# EAGLE design Nabila (EAGLE 9.6.2)
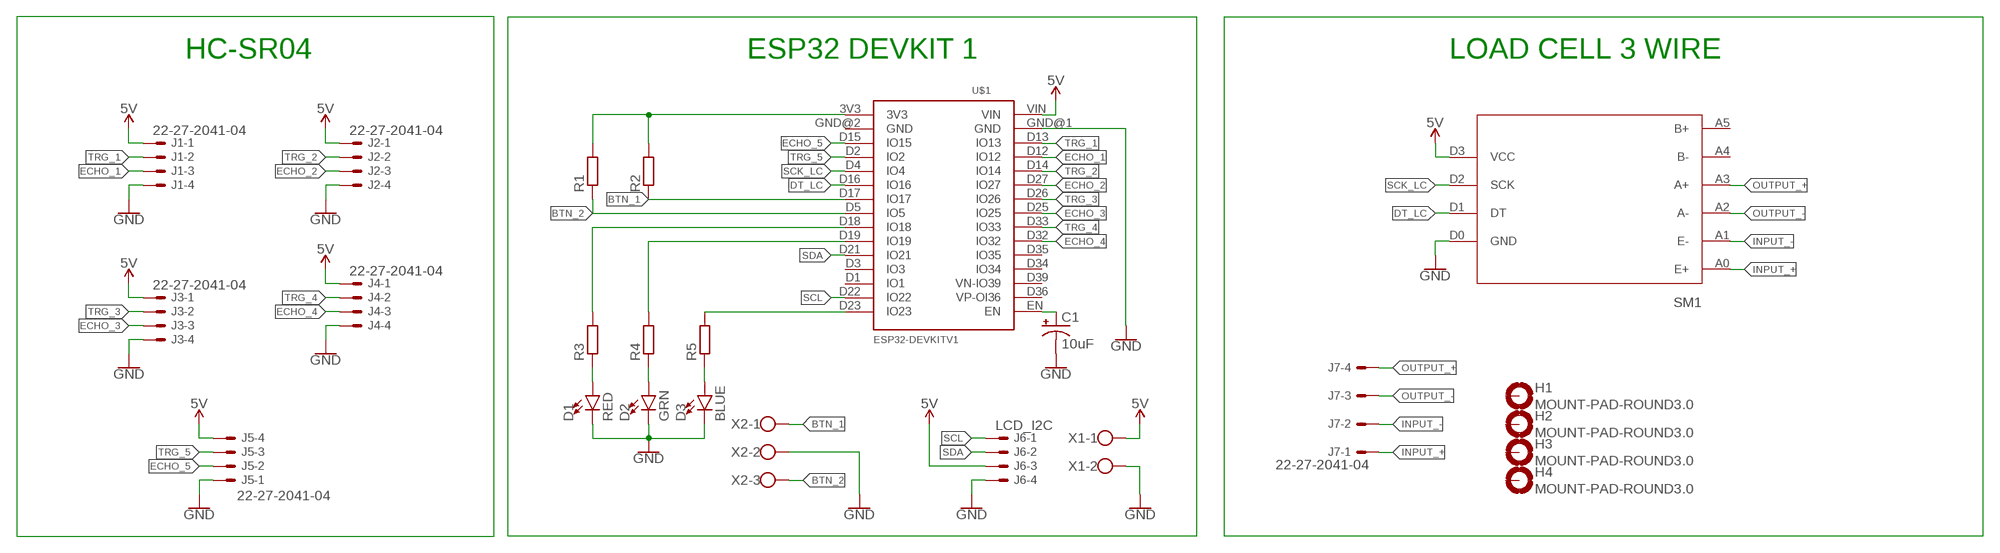
[diagram p0: schematic, sheet 1]

## Parts
C1  10uF  CPOL-USE2-5  [E2-5]
D1  RED  LED5MM  [LED_5MM]
D2  GRN  LED5MM  [LED_5MM]
D3  BLUE  LED5MM  [LED_5MM]
H1  MOUNT-PAD-ROUND3.0  [3,0-PAD]
H2  MOUNT-PAD-ROUND3.0  [3,0-PAD]
H3  MOUNT-PAD-ROUND3.0  [3,0-PAD]
H4  MOUNT-PAD-ROUND3.0  [3,0-PAD]
J1  22-27-2041-04  [6410-04]
J2  22-27-2041-04  [6410-04]
J3  22-27-2041-04  [6410-04]
J4  22-27-2041-04  [6410-04]
J5  22-27-2041-04  [6410-04]
J6  LCD_I2C  22-27-2041-04  [6410-04]
J7  22-27-2041-04  [6410-04]
R1  R-EU_0207/10  [0207/10]
R2  R-EU_0207/10  [0207/10]
R3  R-EU_0207/10  [0207/10]
R4  R-EU_0207/10  [0207/10]
R5  R-EU_0207/10  [0207/10]
SM1  HX711  [HX711]
U$1  ESP32DEVKITV1  [ESP32-DEVKITV1]
X1  W237-102  [W237-102]
X2  W237-103  [W237-103]

## Nets
5V: J1.1 J2.1 J3.1 J4.1 J5.4 J6.3 SM1.D3(VCC) U$1.VIN X1.1
BTN_1: R2.1 U$1.D17(IO17) X2.1
BTN_2: R1.1 U$1.D5(IO5) X2.3
DT_LC: SM1.D1(DT) U$1.D16(IO16)
ECHO_1: J1.3 U$1.D12(IO12)
ECHO_2: J2.3 U$1.D27(IO27)
ECHO_3: J3.3 U$1.D25(IO25)
ECHO_4: J4.3 U$1.D32(IO32)
ECHO_5: J5.2 U$1.D15(IO15)
GND: C1.- D1.K(C) D2.K(C) D3.K(C) J1.4 J2.4 J3.4 J4.4 J5.1 J6.4 SM1.D0(GND) U$1.GND@1(GND) X1.2 X2.2
INPUT_+: J7.1 SM1.A0(E+)
INPUT_-: J7.2 SM1.A1(E-)
N$1: R1.2 R2.2 U$1.3V3
N$4: R3.2 U$1.D18(IO18)
N$5: R4.2 U$1.D19(IO19)
N$6: R5.2 U$1.D23(IO23)
N$7: D1.A R3.1
N$8: D2.A R4.1
N$9: D3.A R5.1
N$11: C1.+ U$1.EN
OUTPUT_+: J7.4 SM1.A3(A+)
OUTPUT_-: J7.3 SM1.A2(A-)
SCK_LC: SM1.D2(SCK) U$1.D4(IO4)
SCL: J6.1 U$1.D22(IO22)
SDA: J6.2 U$1.D21(IO21)
TRG_1: J1.2 U$1.D13(IO13)
TRG_2: J2.2 U$1.D14(IO14)
TRG_3: J3.2 U$1.D26(IO26)
TRG_4: J4.2 U$1.D33(IO33)
TRG_5: J5.3 U$1.D2(IO2)
Unconnected: H1.B3,0(MOUNT) H2.B3,0(MOUNT) H3.B3,0(MOUNT) H4.B3,0(MOUNT) SM1.A4(B-) SM1.A5(B+) U$1.D1(IO1) U$1.D3(IO3) U$1.D34(IO34) U$1.D35(IO35) U$1.D36(VP-OI36) U$1.D39(VN-IO39) U$1.GND@2(GND)

## Notes on the sheet
- HC-SR04 | ESP32 DEVKIT 1 | LOAD CELL 3 WIRE

## Library data of the parts
C1 = rcl:CPOL-US: POLARIZED CAPACITOR, American symbol; SPICEPREFIX: C
D1-D3 = 1206_led:LED: LED (Generic) Standard schematic elements and footprints for 5mm, 3mm, 1206, and 0603 sized LEDs. Generic LEDs with no color specified.
H1-H4 = holes:MOUNT-PAD-ROUND: MOUNTING PAD, round
J1-J7 = con-molex:22-?-04: CONNECTOR wire to board 2.54 mm (.1 inch) pitch header; MF: MOLEX; OC_FARNELL: unknown; OC_NEWARK: unknown
R1-R5 = resistor:R-EU_: RESISTOR, European symbol
SM1 = hx711:HX711: HX711 module is a Load Cell Amplifier breakout board for the HX711 IC that allows you to easily read load cells to measure weight. This module uses 24 high precision A/D converter chip HX711. It is a specially designed for the high precision electronic scale design, with two analog input channel, the internal integration of 128 times the programmable gain amplifier. The input circuit can be configured to provide a bridge type pressure bridge (such as pressure, weighing sensor mode), is of high precision, low cost is an ideal sampling front-end module.
U$1 = ESP32-DEVKITV1:ESP32DEVKITV1
X1 = con-wago-500:W237-102: WAGO SCREW CLAMP; MPN: 237-102; OC_FARNELL: unknown; OC_NEWARK: 70K9898
X2 = con-wago-500:W237-103: WAGO SCREW CLAMP; MPN: 237-103; OC_FARNELL: unknown; OC_NEWARK: 18M7116

## Board
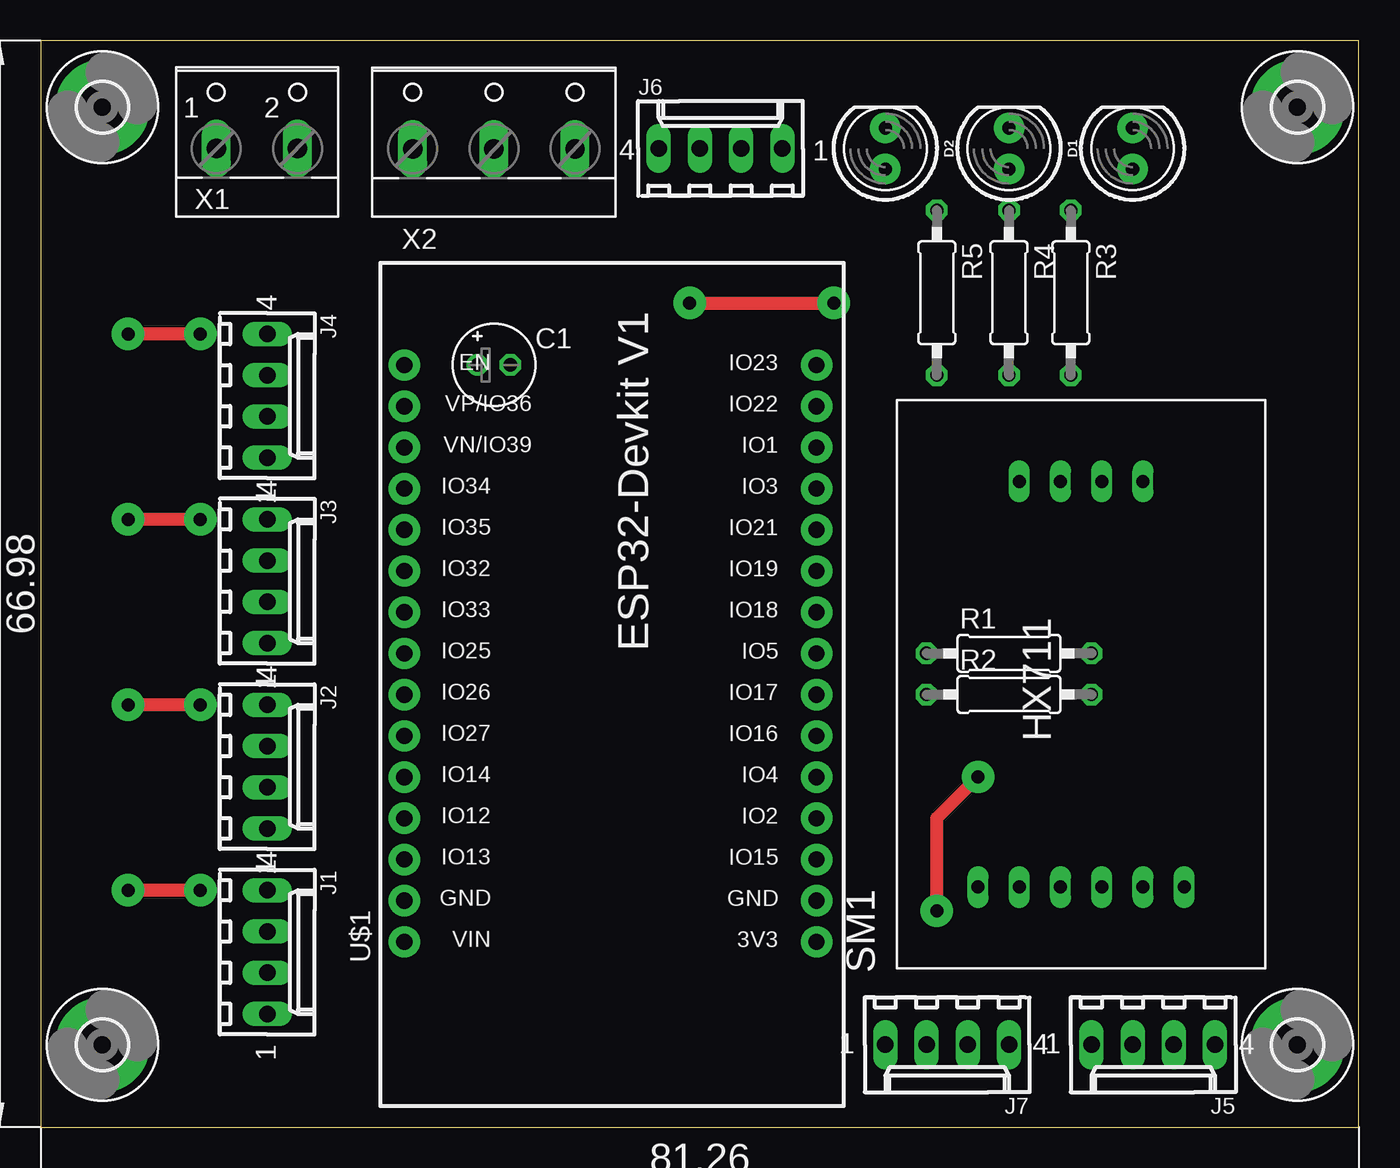
[diagram p1: board, top side]
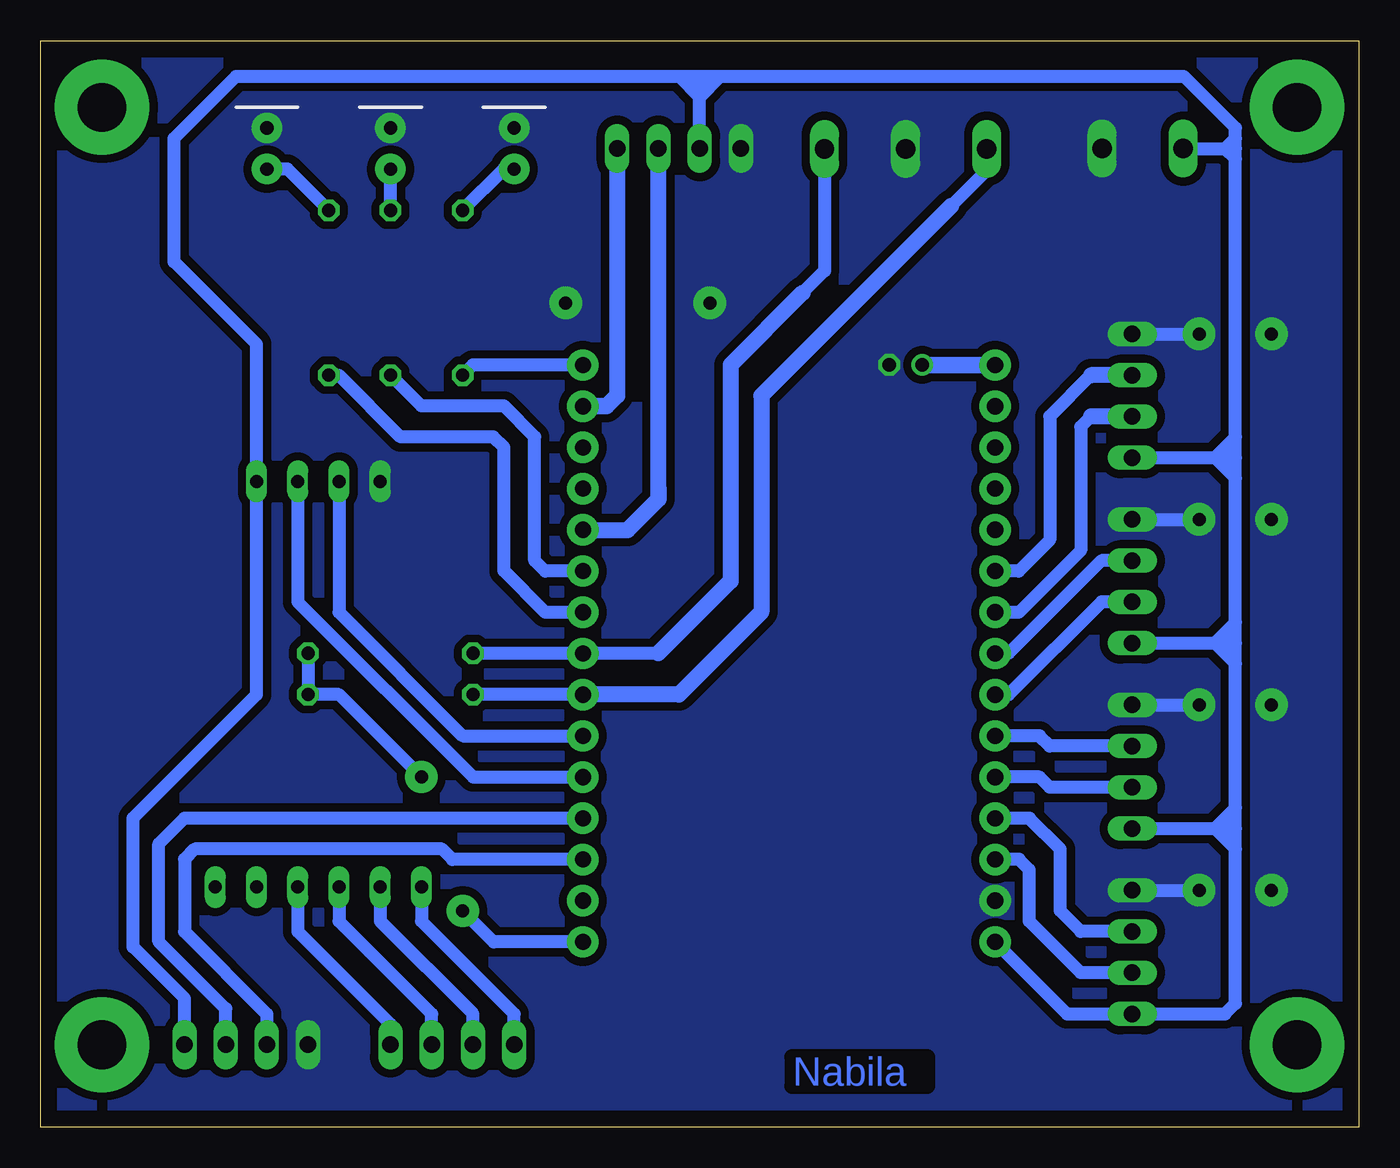
[diagram p2: board, bottom side, seen from below]

Size 81.26 x 66.98 mm. Coordinates in mm from the lower left corner, seen from the top.
Outline: 0,0 81.26,0 81.26,66.98 0,66.98 0,0
Copper layers (1*16): Top 0.035mm / dielectric 1.5mm / Bottom 0.035mm
Design rules "default *": minimum track width 32mil, minimum drill 0.35mm, track to track 0.5mm, track to pad 0.5mm, pad to pad 0.5mm, via to via 0.5mm, smd to smd 6mil, copper to edge 40mil, drill to drill 6mil, minimum pad ring 10mil, minimum via ring 8mil, stop-mask expansion 4mil, vias tented up to drill 0mil, thermal gap 10mil

### Footprints (pad centres in the part's own frame; a part is rotated, then mirrored left to right if it is on the bottom)
E2-5 = drill 0.813 pad 1.27: + -1.016,0 | drill 0.813 pad 1.27 octagon: - 1.016,0
LED_5MM = drill 0.813 pad 1.88: A -1.27,0; K 1.27,0
3,0-PAD = drill 3 pad 5.842: B3,0 0,0
6410-04 = drill 1.016 long: 1 3.81,0; 2 1.27,0; 3 -1.27,0; 4 -3.81,0
0207/10 = drill 0.813 octagon: 1 -5.08,0; 2 5.08,0
HX711 = drill 0.8 long: A0 -12.5,6.35; A1 -12.5,3.81; A2 -12.5,1.27; A3 -12.5,-1.27; A4 -12.5,-3.81; A5 -12.5,-6.35; D0 12.5,3.81; D1 12.5,1.27; D2 12.5,-1.27; D3 12.5,-3.81
ESP32-DEVKITV1 = drill 1 pad 1.93: 3V3 -16.52,-12.27; D1 13.96,-12.27; D2 -8.9,-12.27; D3 11.42,-12.27; D4 -6.36,-12.27; D5 1.26,-12.27; D12 -8.9,13.135; D13 -11.44,13.135; D14 -6.36,13.135; D15 -11.44,-12.27; D16 -3.82,-12.27; D17 -1.28,-12.27; D18 3.8,-12.27; D19 6.34,-12.27; D21 8.88,-12.27; D22 16.5,-12.27; D23 19.04,-12.27; D25 1.26,13.135; D26 -1.28,13.135; D27 -3.82,13.135; D32 6.34,13.135; D33 3.8,13.135; D34 11.42,13.135; D35 8.88,13.135; D36 16.5,13.135; D39 13.96,13.135; EN 19.04,13.135; GND@1 -13.98,13.135; GND@2 -13.98,-12.27; VIN -16.52,13.135
W237-102 = drill 1.194 long: 1 -2.5,-1.27; 2 2.5,-1.27
W237-103 = drill 1.194 long: 1 -5,-1.29; 2 0,-1.29; 3 5,-1.29

### Placement (x,y rotation side)
C1  27.94,46.99 0 top
D1  67.31,60.33 90 top
D2  59.69,60.33 90 top
D3  52.07,60.33 90 top
H1  3.81,5.08 0 top
H2  3.81,62.87 0 top
H3  77.47,5.08 0 top
H4  77.47,62.87 0 top
J1  13.97,10.79 270 top
J2  13.97,22.23 270 top
J3  13.97,33.66 270 top
J4  13.97,45.09 270 top
J5  68.58,5.08 180 top
J6  41.91,60.33 0 top
J7  55.88,5.08 180 top
R1  59.69,29.21 0 top
R2  59.69,26.67 0 top
R3  63.5,51.44 270 top
R4  59.69,51.44 270 top
R5  55.24,51.44 270 top
SM1  64.14,27.3 90 top
U$1  35.56,27.94 90 top
X1  13.34,61.59 0 top
X2  27.94,61.59 0 top

### Tracks (layer width: path | path; a pad name or v marks a point on that pad's centre or on a via)
5V
  Bottom 0.813: 40.64,64.77 40.64,63.5 | J6.3 40.64,63.5 | 40.64,64.77 39.37,64.77 | 39.37,64.77 10.79,64.77 7.62,61.59 7.62,60.96 | U$1.VIN 17.99,6.99 J1.1 8.26,6.99 7.62,7.62 7.62,17.14 | 7.62,17.14 7.62,18.41 | 7.62,18.41 7.62,19.68 | 7.62,19.68 7.62,28.57 | 7.62,28.57 7.62,29.84 | 7.62,29.84 7.62,31.11 | 7.62,31.11 7.62,40.01 | 7.62,40.01 7.62,41.27 | 7.62,41.27 7.62,42.55 | 7.62,42.55 7.62,59.69 | 7.62,59.69 7.62,60.33 | 7.62,60.33 7.62,60.96 | X1.1 8.26,60.33 | 7.62,60.33 8.26,60.33 | 8.26,60.33 7.62,59.69 | 8.26,60.33 7.62,60.96 | 41.91,64.77 69.22,64.77 73.03,60.96 73.03,53.34 67.94,48.26 SM1.D3 67.94,26.67 75.56,19.05 75.56,11.11 72.39,7.94 J5.4 | 41.91,64.77 40.64,64.77 | 40.64,63.5 41.91,64.77 | 40.64,63.5 39.37,64.77 | J2.1 8.89,18.41 | 7.62,18.41 8.89,18.41 | 8.89,18.41 7.62,17.14 | 8.89,18.41 7.62,19.68 | J3.1 8.89,29.84 | 7.62,29.84 8.89,29.84 | 8.89,29.84 7.62,31.11 | 8.89,29.84 7.62,28.57 | J4.1 8.89,41.27 | 7.62,41.27 8.89,41.27 | 8.89,41.27 7.62,42.55 | 8.89,41.27 7.62,40.01
BTN_1
  Bottom 0.813: U$1.D17 R2.1 | X2.1 22.94,58.98 25.12,56.79
  Bottom 1: U$1.D17 41.92,26.66 36.83,31.75 36.83,45.09 25.12,56.79
BTN_2
  Bottom 0.813: R1.1 U$1.D5 43.19,29.2 | X2.3 32.94,52.78 34.29,51.44
  Bottom 1: 34.29,51.44 38.73,46.99 38.73,33.66 43.19,29.2
DT_LC
  Bottom 0.813: SM1.D1 62.87,31.75 55.23,24.12 U$1.D16
ECHO_1
  Bottom 0.813: J1.3 17.14,12.06 18.41,13.34 18.41,17.14 20.31,19.04 U$1.D12
ECHO_2
  Bottom 0.813: J2.3 19.05,23.5 19.68,24.13 22.41,24.13 U$1.D27
ECHO_3
  Bottom 0.813: J3.3 15.88,34.92 21.6,29.2 U$1.D25
ECHO_4
  Bottom 0.813: 16.51,46.35 19.05,43.81 19.05,36.2 20.96,34.28 U$1.D32
  Bottom 1: J4.3 16.51,46.35
ECHO_5
  Bottom 0.813: U$1.D15 55.87,16.5 56.52,17.14 71.75,17.14 72.39,16.51 72.39,12.06 67.31,6.99 J5.2
GND  (via drill 0.8 pad 2)
  Top 0.813: v9.84,14.61 v5.4,14.61 | v9.84,26.04 v5.4,26.04 | v9.84,37.47 v5.4,37.47 | v9.84,48.9 v5.4,48.9 | v40.01,50.8 v48.9,50.8
  Bottom 0.813: J1.4 v9.84,14.61 | J2.4 v9.84,26.04 | J3.4 v9.84,37.47 | J4.4 v9.84,48.9
  pour Bottom (no thermals): -0.64,67.31 81.92,67.31 81.92,-0.64 -0.64,-0.64
INPUT_+
  Bottom 0.813: J7.1 52.07,6.99 57.78,12.7 SM1.A0
INPUT_-
  Bottom 0.813: SM1.A1 60.33,12.7 54.61,6.99 J7.2
N$1  (via drill 0.8 pad 2)
  Top 0.813: v55.24,13.34 55.24,19.05 v57.78,21.59
  Bottom 0.813: R1.2 R2.2 62.87,26.67 v57.78,21.59 | U$1.3V3 53.33,11.42 v55.24,13.34
N$4
  Bottom 0.813: U$1.D18 50.16,31.74 52.7,34.29 52.7,41.91 53.34,42.55 59.05,42.55 62.87,46.35 R3.2
N$5
  Bottom 0.813: U$1.D19 50.16,34.28 50.8,34.92 50.8,42.55 52.7,44.45 57.78,44.45 R4.2
N$6
  Bottom 0.813: U$1.D23 54.62,46.98 R5.2
N$7
  Bottom 0.813: R3.1 66.04,59.05 D1.A
N$8
  Bottom 0.813: R4.1 D2.A
N$9
  Bottom 0.813: R5.1 52.7,59.05 D3.A
N$11
  Bottom 1.016: U$1.EN 26.83,46.99 C1.+
OUTPUT_+
  Bottom 0.813: SM1.A3 65.41,12.06 59.69,6.35 J7.4
OUTPUT_-
  Bottom 0.813: J7.3 57.15,6.99 62.87,12.7 SM1.A2
SCK_LC
  Bottom 0.813: SM1.D2 65.41,32.38 54.6,21.58 U$1.D4
SCL
  Bottom 1: J6.1 45.72,45.09
  Bottom 1.016: U$1.D22 46.37,44.44 45.72,45.09
SDA
  Bottom 1: U$1.D21 45.09,36.82 | 43.18,39.37 J6.2
  Bottom 1.016: 45.09,36.82 43.18,38.73 43.18,39.37
TRG_1
  Bottom 0.813: J1.2 17.14,9.53 20.32,12.7 20.32,15.88 20.95,16.51 22.41,16.51 U$1.D13
TRG_2
  Bottom 0.813: J2.2 19.05,20.95 19.68,21.59 22.41,21.59 U$1.D14
TRG_3
  Bottom 0.813: J3.2 15.88,32.38 21.6,26.66 U$1.D26
TRG_4
  Bottom 0.813: 16.51,43.81 17.14,43.18 17.14,35.56 20.96,31.74 U$1.D33
  Bottom 1: J4.2 16.51,43.81
TRG_5
  Bottom 0.813: J5.3 69.85,7.3 73.98,11.43 73.98,17.46 72.39,19.05 U$1.D2

### Text on the board
Bottom: Nabila